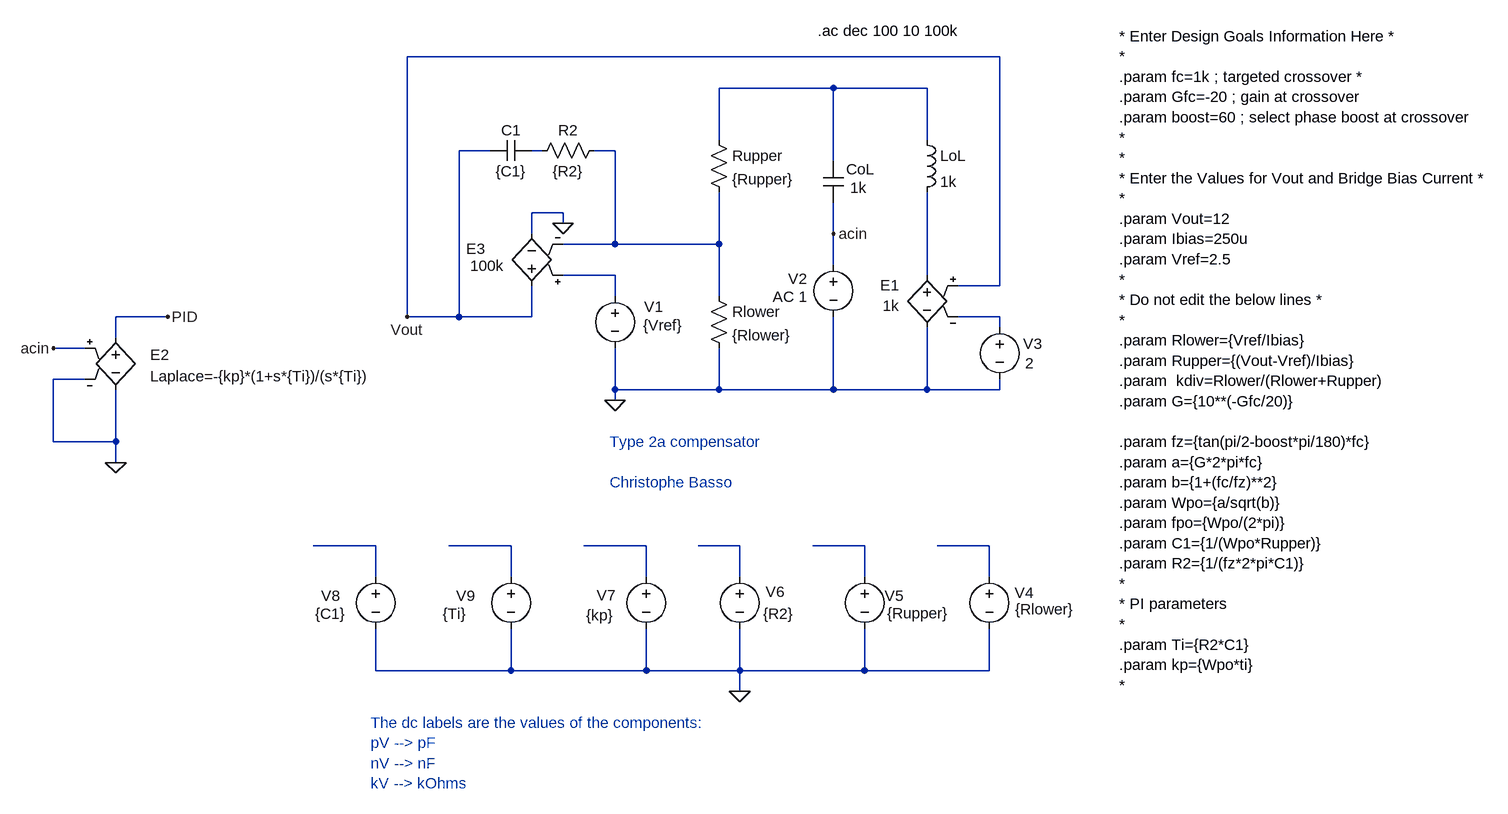
[diagram p0: schematic type 2a - op amp.asc]
type 2a - op amp.asc, the LTspice schematic file:
Version 4
SHEET 1 1636 1116
WIRE 832 -128 -80 -128
WIRE 576 -80 400 -80
WIRE 720 -80 576 -80
WIRE 400 0 400 -80
WIRE 720 0 720 -80
WIRE 48 16 0 16
WIRE 128 16 112 16
WIRE 240 16 208 16
WIRE 576 32 576 -80
WIRE 160 112 112 112
WIRE 160 128 160 112
WIRE 112 144 112 112
WIRE 576 144 576 96
WIRE 240 160 240 16
WIRE 240 160 160 160
WIRE 400 160 400 80
WIRE 400 160 240 160
WIRE 576 192 576 144
WIRE 240 208 160 208
WIRE 720 208 720 80
WIRE 832 224 832 -128
WIRE 832 224 768 224
WIRE 240 240 240 208
WIRE 400 240 400 160
WIRE -448 272 -528 272
WIRE -80 272 -80 -128
WIRE 0 272 0 16
WIRE 0 272 -80 272
WIRE 112 272 112 224
WIRE 112 272 0 272
WIRE 832 272 768 272
WIRE 832 288 832 272
WIRE -528 304 -528 272
WIRE -576 320 -624 320
WIRE -576 368 -624 368
WIRE 240 384 240 320
WIRE 400 384 400 320
WIRE 400 384 240 384
WIRE 576 384 576 272
WIRE 576 384 400 384
WIRE 720 384 720 288
WIRE 720 384 576 384
WIRE 832 384 832 368
WIRE 832 384 720 384
WIRE 240 400 240 384
WIRE -624 464 -624 368
WIRE -528 464 -528 384
WIRE -528 464 -624 464
WIRE -528 496 -528 464
WIRE -128 624 -224 624
WIRE 80 624 -16 624
WIRE 288 624 192 624
WIRE 432 624 368 624
WIRE 624 624 544 624
WIRE 816 624 736 624
WIRE -128 672 -128 624
WIRE 80 672 80 624
WIRE 288 672 288 624
WIRE 432 672 432 624
WIRE 624 672 624 624
WIRE 816 672 816 624
WIRE -128 816 -128 752
WIRE 80 816 80 752
WIRE 80 816 -128 816
WIRE 288 816 288 752
WIRE 288 816 80 816
WIRE 432 816 432 752
WIRE 432 816 288 816
WIRE 624 816 624 752
WIRE 624 816 432 816
WIRE 816 816 816 752
WIRE 816 816 624 816
WIRE 432 848 432 816
FLAG 240 400 0
FLAG -80 272 Vout
FLAG 432 848 0
FLAG -528 496 0
FLAG -448 272 PID
FLAG -624 320 acin
FLAG 160 128 0
FLAG 576 144 acin
DATAFLAG 640 -80 ""
DATAFLAG 112 -128 ""
DATAFLAG 304 160 ""
DATAFLAG -208 624 ""
DATAFLAG 224 624 ""
DATAFLAG 400 624 ""
DATAFLAG 560 624 ""
DATAFLAG 768 624 ""
DATAFLAG 0 624 ""
SYMBOL res 384 224 R0
SYMATTR InstName Rlower
SYMATTR Value {Rlower}
SYMBOL res 384 -16 R0
SYMATTR InstName Rupper
SYMATTR Value {Rupper}
SYMBOL voltage 240 224 R0
WINDOW 0 45 32 Left 2
WINDOW 3 43 61 Left 2
WINDOW 123 0 0 Left 0
WINDOW 39 0 0 Left 0
SYMATTR InstName V1
SYMATTR Value {Vref}
SYMBOL cap 112 0 R90
WINDOW 0 0 32 VBottom 2
WINDOW 3 32 32 VTop 2
SYMATTR InstName C1
SYMATTR Value {C1}
SYMBOL cap 560 32 R0
WINDOW 0 36 13 Left 2
WINDOW 3 42 41 Left 2
SYMATTR InstName CoL
SYMATTR Value 1k
SYMBOL voltage 576 176 M0
WINDOW 0 40 37 Left 2
WINDOW 123 40 65 Left 2
WINDOW 39 0 0 Left 0
SYMATTR InstName V2
SYMATTR Value2 AC 1
SYMATTR Value ""
SYMBOL ind 704 -16 R0
SYMATTR InstName LoL
SYMATTR Value 1k
SYMBOL e 720 192 M0
WINDOW 0 43 31 Left 2
WINDOW 3 43 63 Left 2
SYMATTR InstName E1
SYMATTR Value 1k
SYMBOL voltage 832 272 R0
WINDOW 0 36 41 Left 2
WINDOW 3 39 71 Left 2
SYMATTR InstName V3
SYMATTR Value 2
SYMBOL res 224 0 R90
WINDOW 0 0 56 VBottom 2
WINDOW 3 32 56 VTop 2
SYMATTR InstName R2
SYMATTR Value {R2}
SYMBOL voltage 816 656 R0
WINDOW 0 39 40 Left 2
WINDOW 3 40 66 Left 2
WINDOW 123 0 0 Left 0
WINDOW 39 0 0 Left 0
SYMATTR InstName V4
SYMATTR Value {Rlower}
SYMBOL voltage 624 656 R0
WINDOW 0 31 45 Left 2
WINDOW 3 35 72 Left 2
WINDOW 123 0 0 Left 0
WINDOW 39 0 0 Left 0
SYMATTR InstName V5
SYMATTR Value {Rupper}
SYMBOL voltage 432 656 R0
WINDOW 0 40 39 Left 2
WINDOW 3 36 73 Left 2
WINDOW 123 0 0 Left 0
WINDOW 39 0 0 Left 0
SYMATTR InstName V6
SYMATTR Value {R2}
SYMBOL voltage 288 656 R0
WINDOW 0 -76 44 Left 2
WINDOW 3 -92 75 Left 2
SYMATTR InstName V7
SYMATTR Value {kp}
SYMBOL voltage -128 656 R0
WINDOW 0 -84 45 Left 2
WINDOW 3 -93 73 Left 2
WINDOW 123 0 0 Left 0
WINDOW 39 0 0 Left 0
SYMATTR InstName V8
SYMATTR Value {C1}
SYMBOL voltage 80 656 R0
WINDOW 0 -84 45 Left 2
WINDOW 3 -105 73 Left 2
WINDOW 123 0 0 Left 0
WINDOW 39 0 0 Left 0
SYMATTR InstName V9
SYMATTR Value {Ti}
SYMBOL e -528 288 R0
WINDOW 0 53 42 Left 2
WINDOW 3 53 75 Left 2
SYMATTR InstName E2
SYMATTR Value Laplace=-{kp}*(1+s*{Ti})/(s*{Ti})
SYMBOL e 112 240 R180
WINDOW 0 72 73 Left 2
WINDOW 3 42 47 Left 2
SYMATTR InstName E3
SYMATTR Value 100k
TEXT 1016 -160 Left 2 !* Enter Design Goals Information Here *\n*\n.param fc=1k ; targeted crossover *\n.param Gfc=-20 ; gain at crossover\n.param boost=60 ; select phase boost at crossover\n*\n*\n* Enter the Values for Vout and Bridge Bias Current *\n*\n.param Vout=12\n.param Ibias=250u\n.param Vref=2.5\n*\n* Do not edit the below lines *\n*\n.param Rlower={Vref/Ibias}\n.param Rupper={(Vout-Vref)/Ibias}\n.param  kdiv=Rlower/(Rlower+Rupper)\n.param G={10**(-Gfc/20)}\n \n.param fz={tan(pi/2-boost*pi/180)*fc}\n.param a={G*2*pi*fc}\n.param b={1+(fc/fz)**2}\n.param Wpo={a/sqrt(b)}\n.param fpo={Wpo/(2*pi)}\n.param C1={1/(Wpo*Rupper)}\n.param R2={1/(fz*2*pi*C1)}\n*\n* PI parameters\n*\n.param Ti={R2*C1}\n.param kp={Wpo*ti}\n*
TEXT 552 -168 Left 2 !.ac dec 100 10 100k
TEXT 232 464 Left 2 ;Type 2a compensator\n \nChristophe Basso
TEXT -136 896 Left 2 ;The dc labels are the values of the components:\npV --> pF\nnV --> nF\nkV --> kOhms

The netlist it stands for:
* type 2a - op amp.asc
Rlower N003 0 {Rlower}
Rupper N001 N003 {Rupper}
V1 N004 0 {Vref}
C1 N002 Vout {C1}
CoL N001 acin 1k
V2 acin 0 AC 1
LoL N001 N005 1k
E1 N005 0 Vout N006 1k
V3 N006 0 2
R2 N003 N002 {R2}
V4 N012 0 {Rlower}
V5 N011 0 {Rupper}
V6 N010 0 {R2}
V7 N009 0 {kp}
V8 N007 0 {C1}
V9 N008 0 {Ti}
E2 PID 0 acin 0 Laplace=-{kp}*(1+s*{Ti})/(s*{Ti})
E3 Vout 0 N004 N003 100k
* Enter Design Goals Information Here *
*
.param fc=1k ; targeted crossover *
.param Gfc=-20 ; gain at crossover
.param boost=60 ; select phase boost at crossover
*
*
* Enter the Values for Vout and Bridge Bias Current *
*
.param Vout=12
.param Ibias=250u
.param Vref=2.5
*
* Do not edit the below lines *
*
.param Rlower={Vref/Ibias}
.param Rupper={(Vout-Vref)/Ibias}
.param  kdiv=Rlower/(Rlower+Rupper)
.param G={10**(-Gfc/20)}
.param fz={tan(pi/2-boost*pi/180)*fc}
.param a={G*2*pi*fc}
.param b={1+(fc/fz)**2}
.param Wpo={a/sqrt(b)}
.param fpo={Wpo/(2*pi)}
.param C1={1/(Wpo*Rupper)}
.param R2={1/(fz*2*pi*C1)}
*
* PI parameters
*
.param Ti={R2*C1}
.param kp={Wpo*ti}
*
.ac dec 100 10 100k
* Type 2a compensator
* Christophe Basso
* The dc labels are the values of the components:
* pV --> pF
* nV --> nF
* kV --> kOhms
.backanno
.end